# EAGLE schematic Simulated05 (EAGLE 9.5.2)
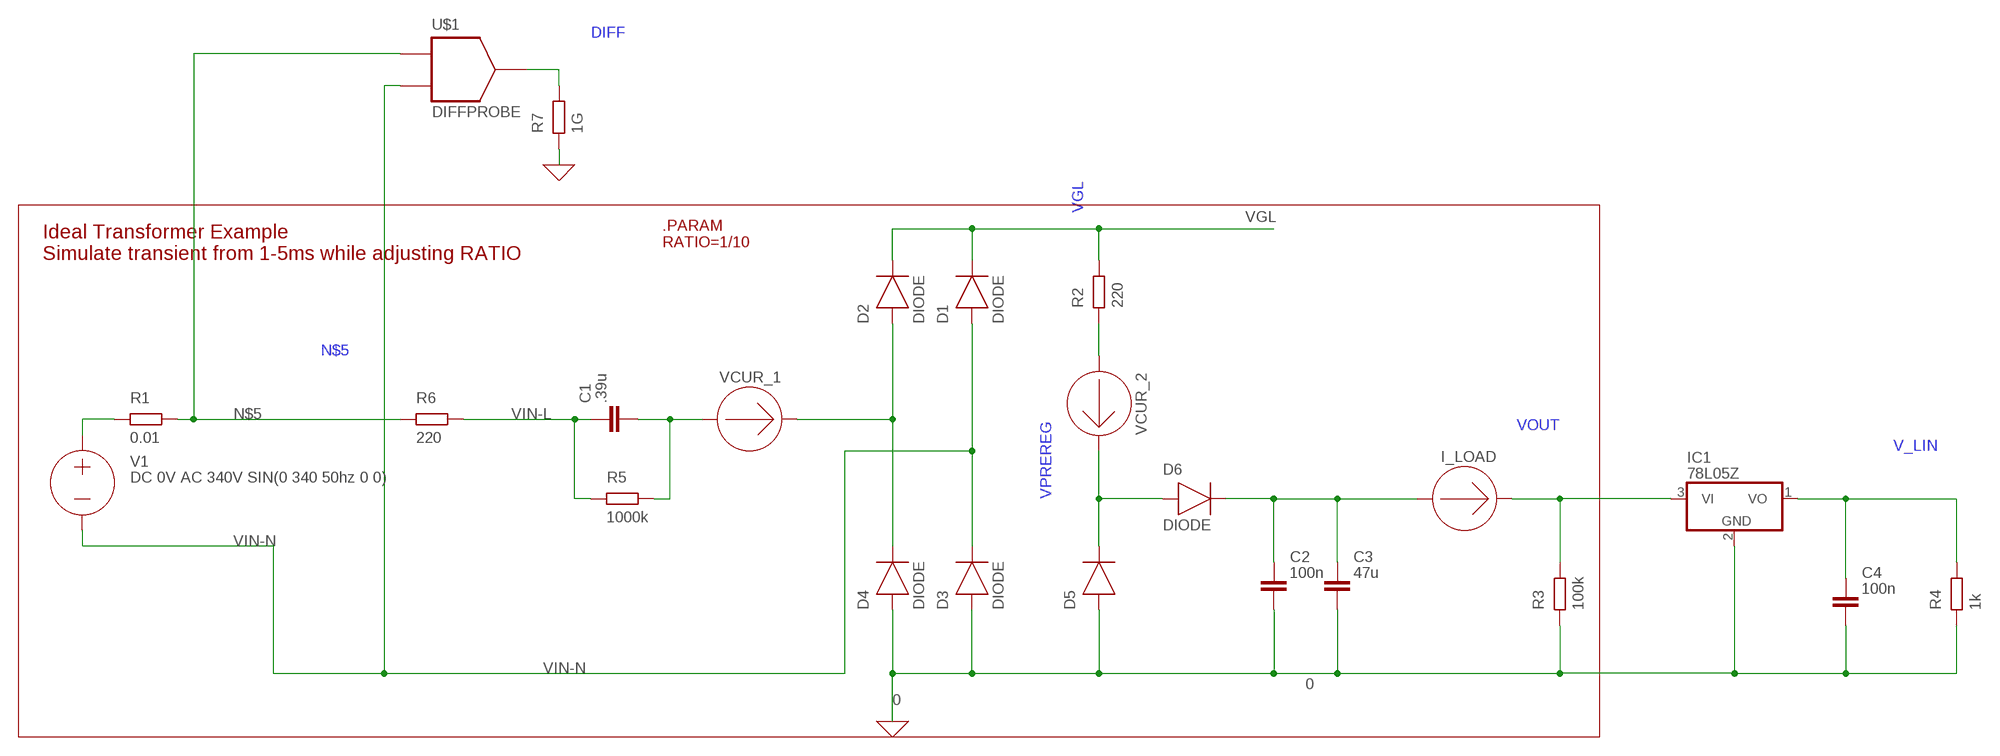
[diagram p0: schematic, sheet 1]

## Parts
C1  .39u  C  (no package)
C2  100n  C  (no package)
C3  47u  C  (no package)
C4  100n  C  (no package)
D1  DIODE  (no package)
D2  DIODE  (no package)
D3  DIODE  (no package)
D4  DIODE  (no package)
D5  DIODE  (no package)
D6  DIODE  (no package)
I_LOAD  AMMETER  (no package)
IC1  78L05Z  [TO92]
R1  0.01  R  (no package)
R2  220  R  (no package)
R3  100k  R  (no package)
R4  1k  R  (no package)
R5  1000k  R  (no package)
R6  220  R  (no package)
R7  1G  R  (no package)
U$1  DIFFPROBE  (no package)
V1  DC 0V AC 340V SIN(0 340 50hz 0 0)  VOLTAGE  (no package)
VCUR_1  DC 0V AC 0  AMMETER  (no package)
VCUR_2  AMMETER  (no package)

## Nets
0: C2.2 C3.2 C4.2 D3.A D4.A D5.A IC1.2(GND) R3.1 R4.1 R7.1 ; supply symbol labelled GND
DIFF: R7.2 U$1.OUT
N$2: R1.1 V1.+
N$3: D2.A D4.C VCUR_1.-
N$4: C1.2 R5.2 VCUR_1.+
N$5: R1.2 R6.1 U$1.IN+
N$7: R2.1 VCUR_2.+
V_LIN: C4.1 IC1.1(VO) R4.2
VGL [dcgnd]: D1.C D2.C R2.2
VIN-L: C1.1 R5.1 R6.2
VIN-N: D1.A D3.C U$1.IN- V1.-
VOUT: I_LOAD.- IC1.3(VI) R3.2
VPREREG: D5.C D6.A VCUR_2.-
VREG: C2.1 C3.1 D6.C I_LOAD.+

## Notes on the sheet
- .PARAM
  RATIO=1/10
- Ideal Transformer Example
  Simulate transient from 1-5ms while adjusting RATIO

## Library data of the parts
C1-C4 = ngspice-simulation:C: CAPACITOR
D1-D4 D6 = ngspice-simulation:DIODE: Diode; SPICEPREFIX: D
D5 = ngspice-simulation:DIODE: Diode; SPICEMODEL: DI_BZT52C9V1LP; SPICEPREFIX: X
I_LOAD VCUR_1 VCUR_2 = ngspice-simulation:AMMETER: AMMETER
IC1 = linear:78*: Positive VOLTAGE REGULATOR Source: http://cache.national.com/ds/LM/LM78L05.pdf http://www.fairchildsemi.com/ds/LM/LM7805.pdf; SPICEMODEL: LM7805; SPICEPREFIX: X
R1-R7 = ngspice-simulation:R: RESISTOR
U$1 = simulation:DIFFPROBE
V1 = ngspice-simulation:VOLTAGE: Independent Voltage Source, either DC, AC, PULSE, SINE, PWL, EXP, or SFFM; VALUE: 0V